# EAGLE schematic SP-PC (EAGLE 7.6.0)

## Sheet 1 of 2
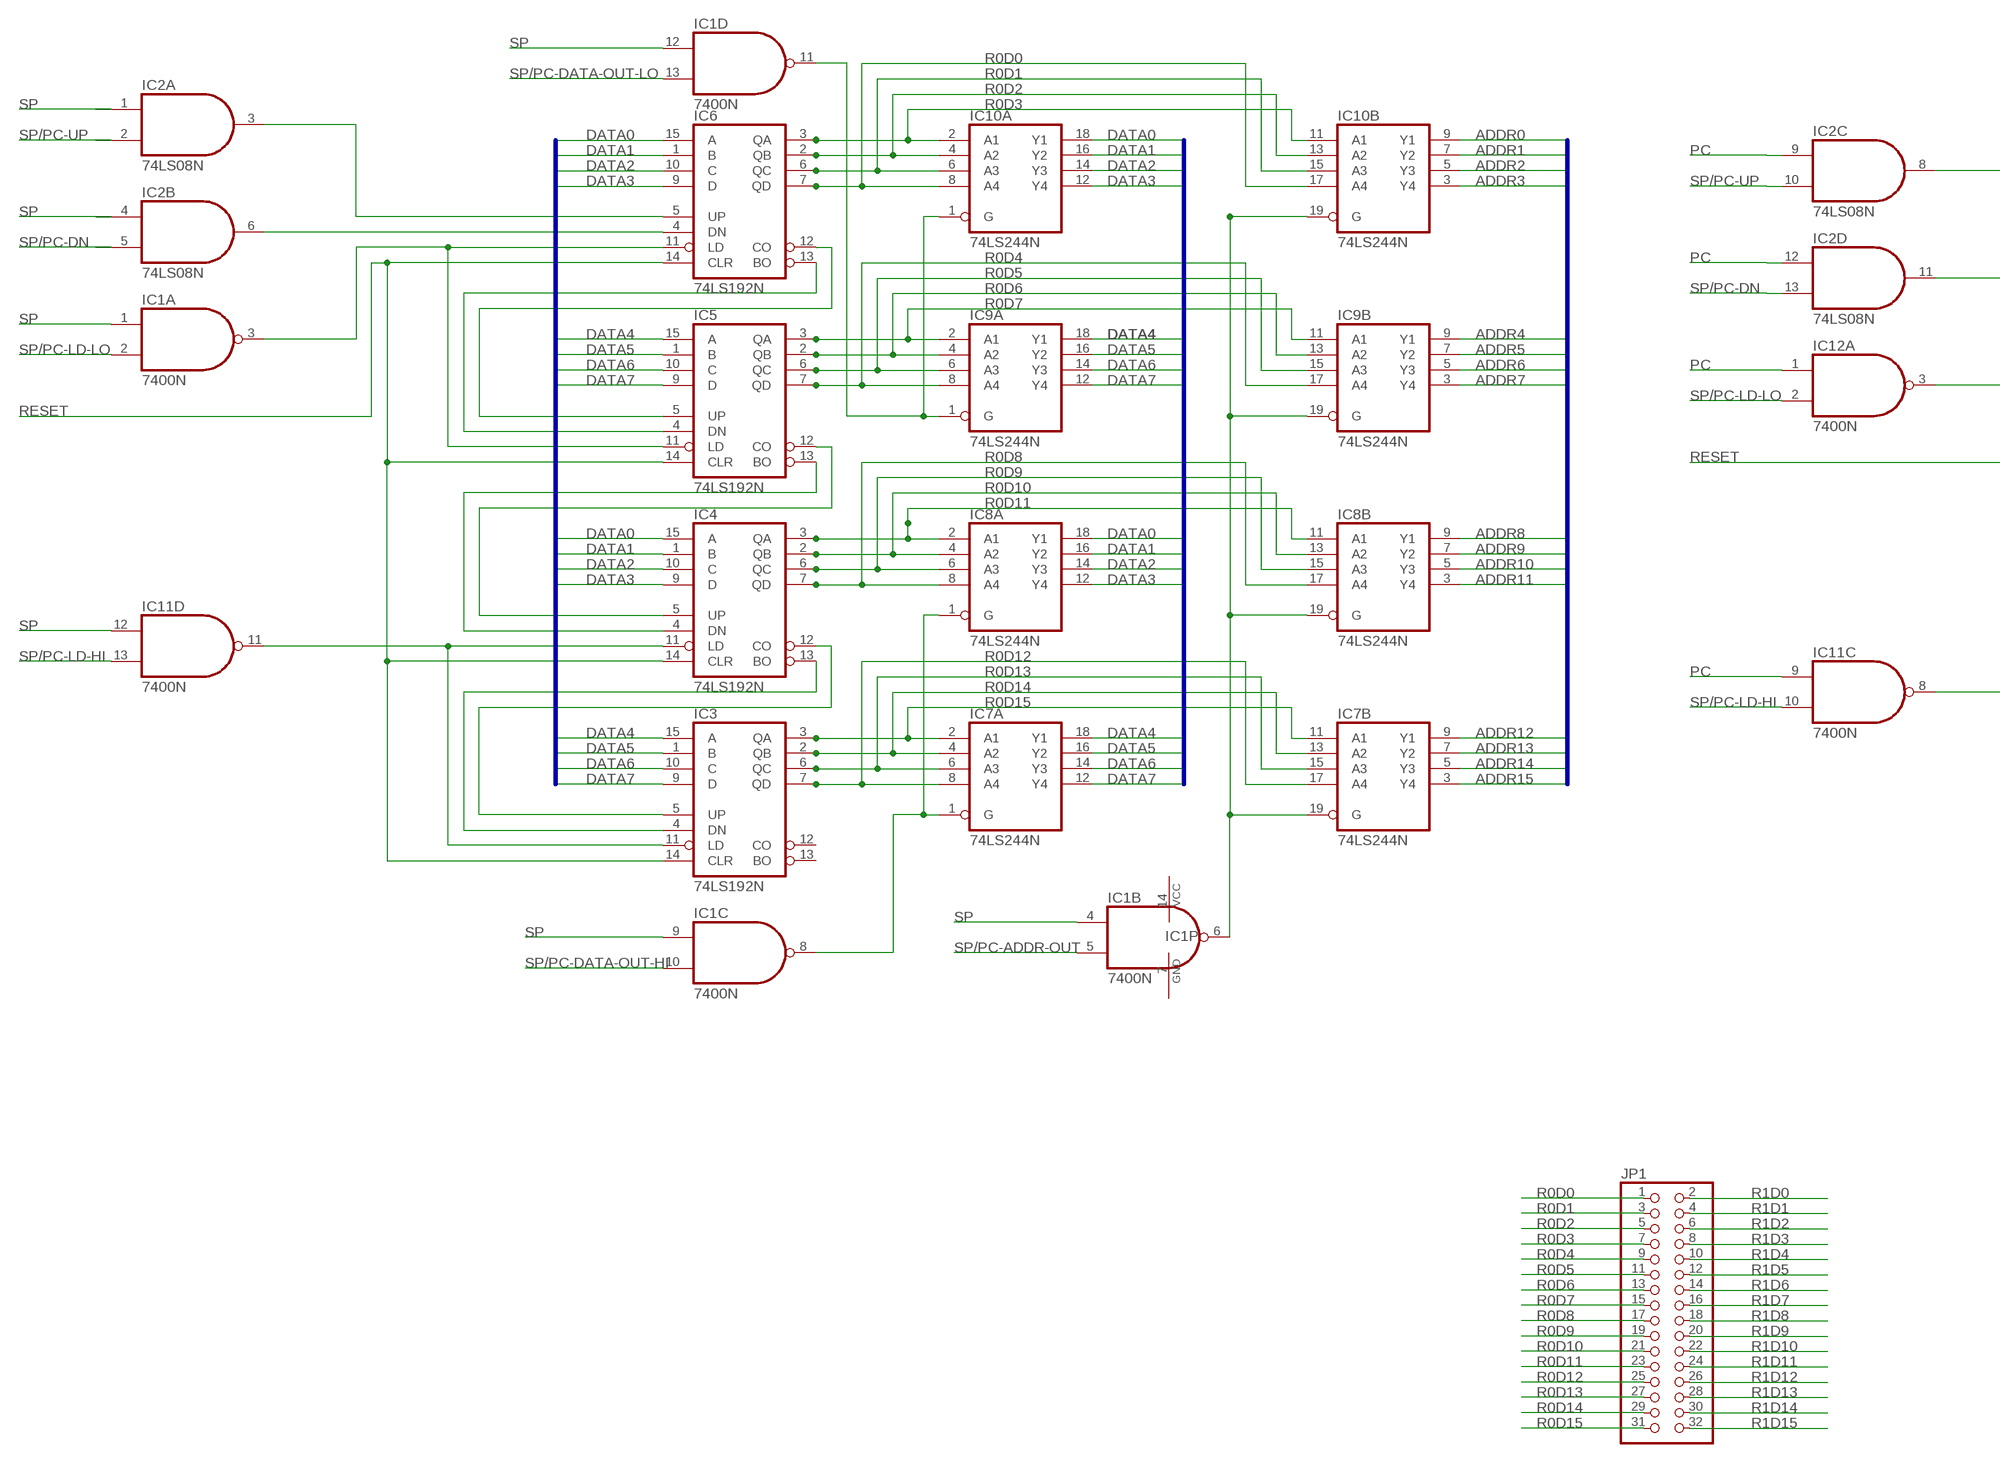
[diagram p0: schematic, sheet 1, part 1 of 2]
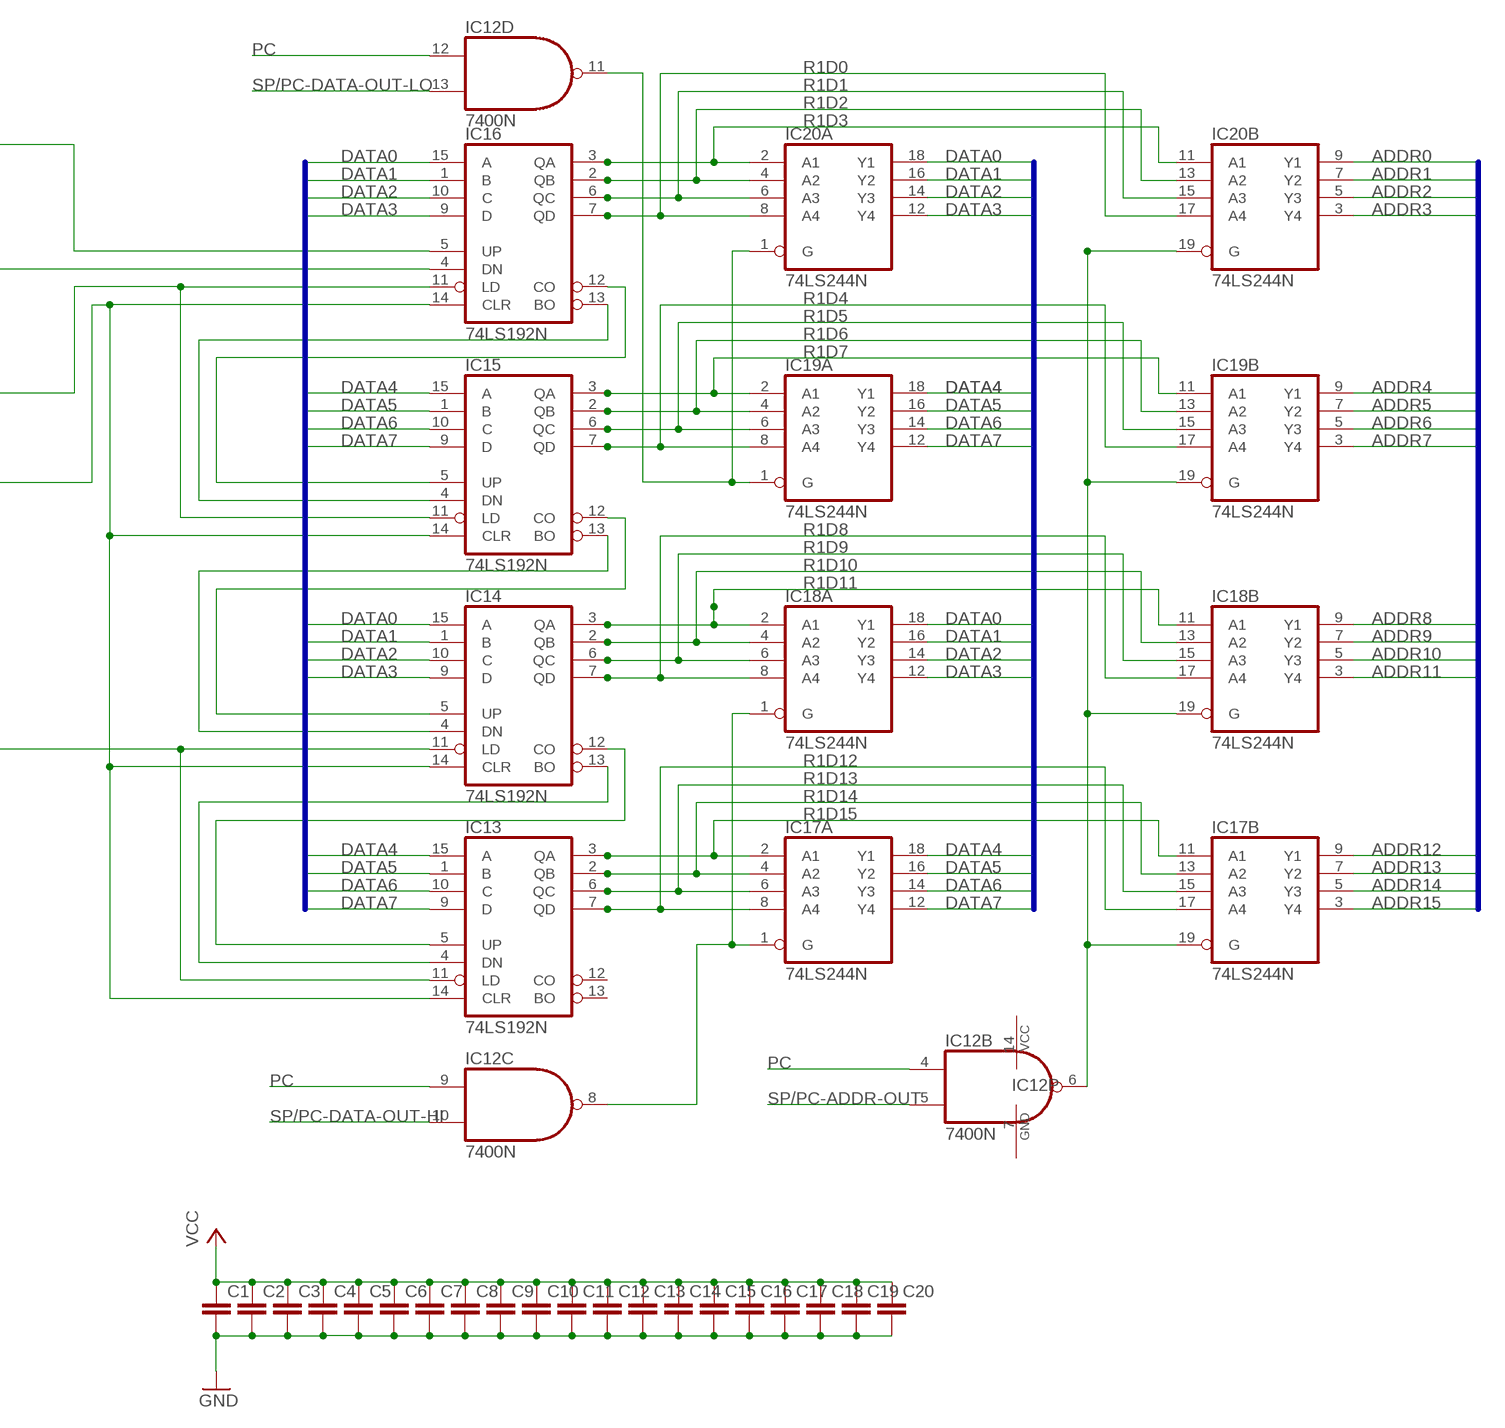
[diagram p1: schematic, sheet 1, part 2 of 2]

### Parts
C1  C2.5/2  [C2.5-2]
C2  C2.5/2  [C2.5-2]
C3  C2.5/2  [C2.5-2]
C4  C2.5/2  [C2.5-2]
C5  C2.5/2  [C2.5-2]
C6  C2.5/2  [C2.5-2]
C7  C2.5/2  [C2.5-2]
C8  C2.5/2  [C2.5-2]
C9  C2.5/2  [C2.5-2]
C10  C2.5/2  [C2.5-2]
C11  C2.5/2  [C2.5-2]
C12  C2.5/2  [C2.5-2]
C13  C2.5/2  [C2.5-2]
C14  C2.5/2  [C2.5-2]
C15  C2.5/2  [C2.5-2]
C16  C2.5/2  [C2.5-2]
C17  C2.5/2  [C2.5-2]
C18  C2.5/2  [C2.5-2]
C19  C2.5/2  [C2.5-2]
C20  C2.5/2  [C2.5-2]
IC1  7400N  [DIL14]
IC2  74LS08N  [DIL14]
IC3  74LS192N  [DIL16]
IC4  74LS192N  [DIL16]
IC5  74LS192N  [DIL16]
IC6  74LS192N  [DIL16]
IC7  74LS244N  [DIL20]
IC8  74LS244N  [DIL20]
IC9  74LS244N  [DIL20]
IC10  74LS244N  [DIL20]
IC11  7400N  [DIL14]
IC12  7400N  [DIL14]
IC13  74LS192N  [DIL16]
IC14  74LS192N  [DIL16]
IC15  74LS192N  [DIL16]
IC16  74LS192N  [DIL16]
IC17  74LS244N  [DIL20]
IC18  74LS244N  [DIL20]
IC19  74LS244N  [DIL20]
IC20  74LS244N  [DIL20]
JP1  PINHD-2X16  [2X16]

### Nets
ADDR0: IC10.9(B:Y1) IC20.9(B:Y1) ; also sheet 2
ADDR1: IC10.7(B:Y2) IC20.7(B:Y2) ; also sheet 2
ADDR2: IC10.5(B:Y3) IC20.5(B:Y3) ; also sheet 2
ADDR3: IC10.3(B:Y4) IC20.3(B:Y4) ; also sheet 2
ADDR4: IC9.9(B:Y1) IC19.9(B:Y1) ; also sheet 2
ADDR5: IC9.7(B:Y2) IC19.7(B:Y2) ; also sheet 2
ADDR6: IC9.5(B:Y3) IC19.5(B:Y3) ; also sheet 2
ADDR7: IC9.3(B:Y4) IC19.3(B:Y4) ; also sheet 2
ADDR8: IC8.9(B:Y1) IC18.9(B:Y1) ; also sheet 2
ADDR9: IC8.7(B:Y2) IC18.7(B:Y2) ; also sheet 2
ADDR10: IC8.5(B:Y3) IC18.5(B:Y3) ; also sheet 2
ADDR11: IC8.3(B:Y4) IC18.3(B:Y4) ; also sheet 2
ADDR12: IC7.9(B:Y1) IC17.9(B:Y1) ; also sheet 2
ADDR13: IC7.7(B:Y2) IC17.7(B:Y2) ; also sheet 2
ADDR14: IC7.5(B:Y3) IC17.5(B:Y3) ; also sheet 2
ADDR15: IC7.3(B:Y4) IC17.3(B:Y4) ; also sheet 2
DATA0: IC4.15(A) IC6.15(A) IC8.18(A:Y1) IC10.18(A:Y1) IC14.15(A) IC16.15(A) IC18.18(A:Y1) IC20.18(A:Y1) ; also sheet 2
DATA1: IC4.1(B) IC6.1(B) IC8.16(A:Y2) IC10.16(A:Y2) IC14.1(B) IC16.1(B) IC18.16(A:Y2) IC20.16(A:Y2) ; also sheet 2
DATA2: IC4.10(C) IC6.10(C) IC8.14(A:Y3) IC10.14(A:Y3) IC14.10(C) IC16.10(C) IC18.14(A:Y3) IC20.14(A:Y3) ; also sheet 2
DATA3: IC4.9(D) IC6.9(D) IC8.12(A:Y4) IC10.12(A:Y4) IC14.9(D) IC16.9(D) IC18.12(A:Y4) IC20.12(A:Y4) ; also sheet 2
DATA4: IC3.15(A) IC5.15(A) IC7.18(A:Y1) IC9.18(A:Y1) IC13.15(A) IC15.15(A) IC17.18(A:Y1) IC19.18(A:Y1) ; also sheet 2
DATA5: IC3.1(B) IC5.1(B) IC7.16(A:Y2) IC9.16(A:Y2) IC13.1(B) IC15.1(B) IC17.16(A:Y2) IC19.16(A:Y2) ; also sheet 2
DATA6: IC3.10(C) IC5.10(C) IC7.14(A:Y3) IC9.14(A:Y3) IC13.10(C) IC15.10(C) IC17.14(A:Y3) IC19.14(A:Y3) ; also sheet 2
DATA7: IC3.9(D) IC5.9(D) IC7.12(A:Y4) IC9.12(A:Y4) IC13.9(D) IC15.9(D) IC17.12(A:Y4) IC19.12(A:Y4) ; also sheet 2
GND: C1.2 C2.2 C3.2 C4.2 C5.2 C6.2 C7.2 C8.2 C9.2 C10.2 C11.2 C12.2 C13.2 C14.2 C15.2 C16.2 C17.2 C18.2 C19.2 C20.2 ; also sheet 2
N$10: IC5.4(DN) IC6.13(BO)
N$11: IC5.5(UP) IC6.12(CO)
N$12: IC4.4(DN) IC5.13(BO)
N$13: IC4.5(UP) IC5.12(CO)
N$14: IC3.4(DN) IC4.13(BO)
N$15: IC3.5(UP) IC4.12(CO)
N$16: IC1.3(A:O) IC5.11(LD) IC6.11(LD)
N$17: IC2.3(A:O) IC6.5(UP)
N$18: IC2.6(B:O) IC6.4(DN)
N$19: IC1.6(B:O) IC7.19(B:G) IC8.19(B:G) IC9.19(B:G) IC10.19(B:G)
N$20: IC1.11(D:O) IC9.1(A:G) IC10.1(A:G)
N$21: IC1.8(C:O) IC7.1(A:G) IC8.1(A:G)
N$22: IC3.11(LD) IC4.11(LD) IC11.11(D:O)
N$58: IC15.4(DN) IC16.13(BO)
N$59: IC15.5(UP) IC16.12(CO)
N$60: IC14.4(DN) IC15.13(BO)
N$61: IC14.5(UP) IC15.12(CO)
N$62: IC13.4(DN) IC14.13(BO)
N$63: IC13.5(UP) IC14.12(CO)
N$64: IC12.3(A:O) IC15.11(LD) IC16.11(LD)
N$65: IC2.8(C:O) IC16.5(UP)
N$66: IC2.11(D:O) IC16.4(DN)
N$83: IC12.6(B:O) IC17.19(B:G) IC18.19(B:G) IC19.19(B:G) IC20.19(B:G)
N$84: IC12.11(D:O) IC19.1(A:G) IC20.1(A:G)
N$85: IC12.8(C:O) IC17.1(A:G) IC18.1(A:G)
N$86: IC11.8(C:O) IC13.11(LD) IC14.11(LD)
PC: IC2.9(C:I0) IC2.12(D:I0) IC11.9(C:I0) IC12.1(A:I0) IC12.4(B:I0) IC12.9(C:I0) IC12.12(D:I0)
R0D0: IC6.7(QD) IC10.8(A:A4) IC10.17(B:A4) JP1.1
R0D1: IC6.6(QC) IC10.6(A:A3) IC10.15(B:A3) JP1.3
R0D2: IC6.2(QB) IC10.4(A:A2) IC10.13(B:A2) JP1.5
R0D3: IC6.3(QA) IC10.2(A:A1) IC10.11(B:A1) JP1.7
R0D4: IC5.7(QD) IC9.8(A:A4) IC9.17(B:A4) JP1.9
R0D5: IC5.6(QC) IC9.6(A:A3) IC9.15(B:A3) JP1.11
R0D6: IC5.2(QB) IC9.4(A:A2) IC9.13(B:A2) JP1.13
R0D7: IC5.3(QA) IC9.2(A:A1) IC9.11(B:A1) JP1.15
R0D8: IC4.7(QD) IC8.8(A:A4) IC8.17(B:A4) JP1.17
R0D9: IC4.6(QC) IC8.6(A:A3) IC8.15(B:A3) JP1.19
R0D10: IC4.2(QB) IC8.4(A:A2) IC8.13(B:A2) JP1.21
R0D11: IC4.3(QA) IC8.2(A:A1) IC8.11(B:A1) JP1.23
R0D12: IC3.7(QD) IC7.8(A:A4) IC7.17(B:A4) JP1.25
R0D13: IC3.6(QC) IC7.6(A:A3) IC7.15(B:A3) JP1.27
R0D14: IC3.2(QB) IC7.4(A:A2) IC7.13(B:A2) JP1.29
R0D15: IC3.3(QA) IC7.2(A:A1) IC7.11(B:A1) JP1.31
R1D0: IC16.7(QD) IC20.8(A:A4) IC20.17(B:A4) JP1.2
R1D1: IC16.6(QC) IC20.6(A:A3) IC20.15(B:A3) JP1.4
R1D2: IC16.2(QB) IC20.4(A:A2) IC20.13(B:A2) JP1.6
R1D3: IC16.3(QA) IC20.2(A:A1) IC20.11(B:A1) JP1.8
R1D4: IC15.7(QD) IC19.8(A:A4) IC19.17(B:A4) JP1.10
R1D5: IC15.6(QC) IC19.6(A:A3) IC19.15(B:A3) JP1.12
R1D6: IC15.2(QB) IC19.4(A:A2) IC19.13(B:A2) JP1.14
R1D7: IC15.3(QA) IC19.2(A:A1) IC19.11(B:A1) JP1.16
R1D8: IC14.7(QD) IC18.8(A:A4) IC18.17(B:A4) JP1.18
R1D9: IC14.6(QC) IC18.6(A:A3) IC18.15(B:A3) JP1.20
R1D10: IC14.2(QB) IC18.4(A:A2) IC18.13(B:A2) JP1.22
R1D11: IC14.3(QA) IC18.2(A:A1) IC18.11(B:A1) JP1.24
R1D12: IC13.7(QD) IC17.8(A:A4) IC17.17(B:A4) JP1.26
R1D13: IC13.6(QC) IC17.6(A:A3) IC17.15(B:A3) JP1.28
R1D14: IC13.2(QB) IC17.4(A:A2) IC17.13(B:A2) JP1.30
R1D15: IC13.3(QA) IC17.2(A:A1) IC17.11(B:A1) JP1.32
RESET: IC3.14(CLR) IC4.14(CLR) IC5.14(CLR) IC6.14(CLR) IC13.14(CLR) IC14.14(CLR) IC15.14(CLR) IC16.14(CLR) ; also sheet 2
SP: IC1.1(A:I0) IC1.4(B:I0) IC1.9(C:I0) IC1.12(D:I0) IC2.1(A:I0) IC2.4(B:I0) IC11.12(D:I0)
SP/PC-ADDR-OUT: IC1.5(B:I1) IC12.5(B:I1) ; also sheet 2
SP/PC-DATA-OUT-HI: IC1.10(C:I1) IC12.10(C:I1) ; also sheet 2
SP/PC-DATA-OUT-LO: IC1.13(D:I1) IC12.13(D:I1) ; also sheet 2
SP/PC-DN: IC2.5(B:I1) IC2.13(D:I1) ; also sheet 2
SP/PC-LD-HI: IC11.10(C:I1) IC11.13(D:I1)
SP/PC-LD-LO: IC1.2(A:I1) IC12.2(A:I1)
SP/PC-UP: IC2.2(A:I1) IC2.10(C:I1) ; also sheet 2
VCC: C1.1 C2.1 C3.1 C4.1 C5.1 C6.1 C7.1 C8.1 C9.1 C10.1 C11.1 C12.1 C13.1 C14.1 C15.1 C16.1 C17.1 C18.1 C19.1 C20.1 ; also sheet 2
Unconnected: IC3.12(CO) IC3.13(BO) IC11.1(A:I0) IC11.2(A:I1) IC11.3(A:O) IC11.4(B:I0) IC11.5(B:I1) IC11.6(B:O) IC13.12(CO) IC13.13(BO)

### Buses
ADDR[0..15]
DATA[0..7]

## Sheet 2 of 2
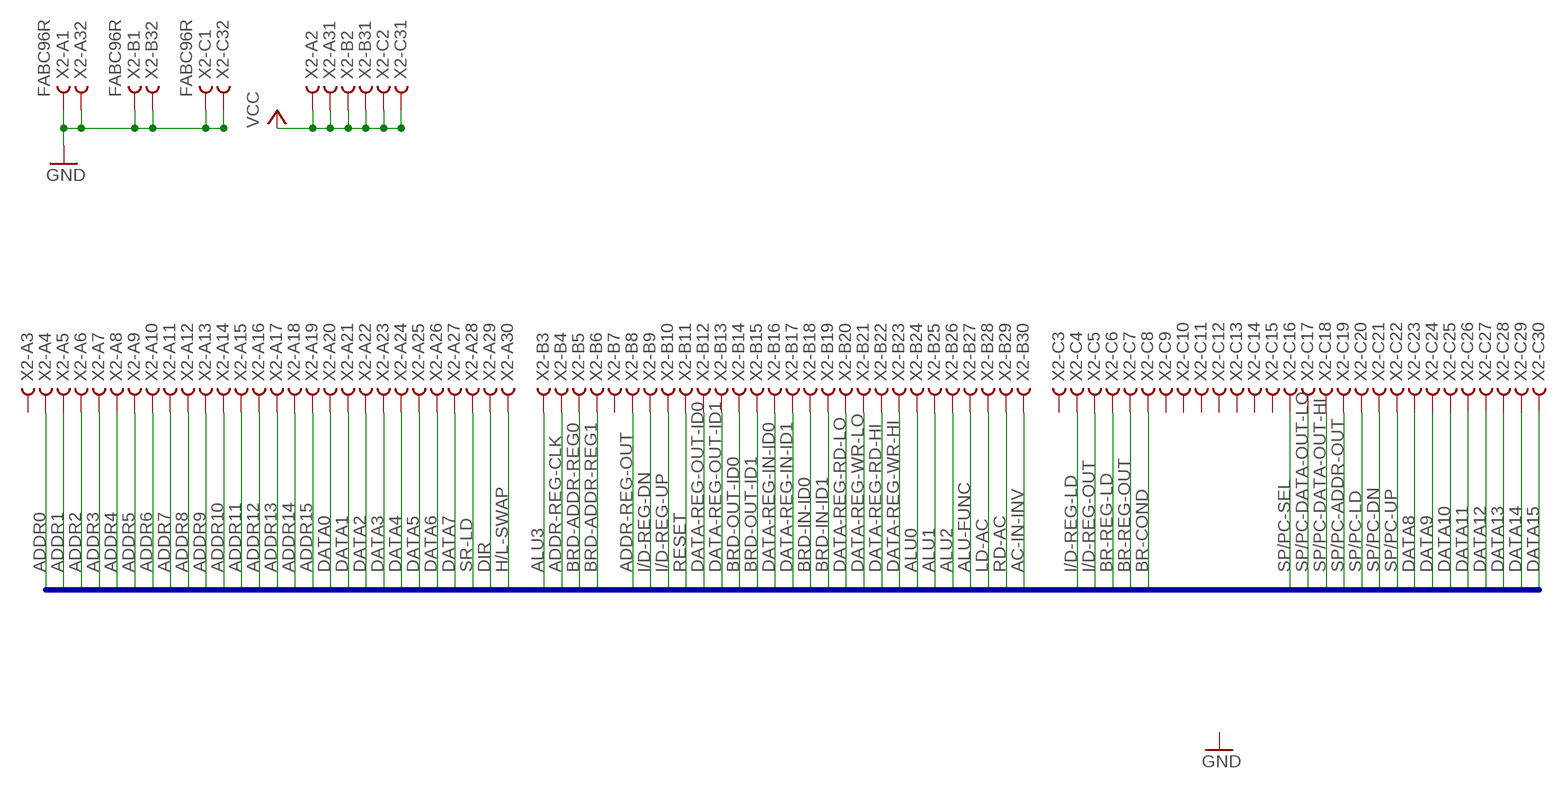
[diagram p2: schematic, sheet 2]

### Parts
X2  FABC96R  [FABC96R]

### Nets
AC-IN-INV: X2.B30
ADDR0: X2.A4 ; also sheet 1
ADDR1: X2.A5 ; also sheet 1
ADDR2: X2.A6 ; also sheet 1
ADDR3: X2.A7 ; also sheet 1
ADDR4: X2.A8 ; also sheet 1
ADDR5: X2.A9 ; also sheet 1
ADDR6: X2.A10 ; also sheet 1
ADDR7: X2.A11 ; also sheet 1
ADDR8: X2.A12 ; also sheet 1
ADDR9: X2.A13 ; also sheet 1
ADDR10: X2.A14 ; also sheet 1
ADDR11: X2.A15 ; also sheet 1
ADDR12: X2.A16 ; also sheet 1
ADDR13: X2.A17 ; also sheet 1
ADDR14: X2.A18 ; also sheet 1
ADDR15: X2.A19 ; also sheet 1
ADDR-REG-CLK: X2.B4
ADDR-REG-OUT: X2.B8
ALU0: X2.B24
ALU1: X2.B25
ALU2: X2.B26
ALU3: X2.B3
ALU-FUNC: X2.B27
BR-COND: X2.C8
BR-REG-LD: X2.C6
BR-REG-OUT: X2.C7
BRD-ADDR-REG0: X2.B5
BRD-ADDR-REG1: X2.B6
BRD-IN-ID0: X2.B18
BRD-IN-ID1: X2.B19
BRD-OUT-ID0: X2.B14
BRD-OUT-ID1: X2.B15
DATA0: X2.A20 ; also sheet 1
DATA1: X2.A21 ; also sheet 1
DATA2: X2.A22 ; also sheet 1
DATA3: X2.A23 ; also sheet 1
DATA4: X2.A24 ; also sheet 1
DATA5: X2.A25 ; also sheet 1
DATA6: X2.A26 ; also sheet 1
DATA7: X2.A27 ; also sheet 1
DATA8: X2.C23
DATA9: X2.C24
DATA10: X2.C25
DATA11: X2.C26
DATA12: X2.C27
DATA13: X2.C28
DATA14: X2.C29
DATA15: X2.C30
DATA-REG-IN-ID0: X2.B16
DATA-REG-IN-ID1: X2.B17
DATA-REG-OUT-ID0: X2.B12
DATA-REG-OUT-ID1: X2.B13
DATA-REG-RD-HI: X2.B22
DATA-REG-RD-LO: X2.B20
DATA-REG-WR-HI: X2.B23
DATA-REG-WR-LO: X2.B21
DIR: X2.A29
GND: X2.A1 X2.A32 X2.B1 X2.B32 X2.C1 X2.C32 ; also sheet 1
H/L-SWAP: X2.A30
I/D-REG-DN: X2.B9
I/D-REG-LD: X2.C4
I/D-REG-OUT: X2.C5
I/D-REG-UP: X2.B10
LD-AC: X2.B28
RD-AC: X2.B29
RESET: X2.B11 ; also sheet 1
SP/PC-ADDR-OUT: X2.C19 ; also sheet 1
SP/PC-DATA-OUT-HI: X2.C18 ; also sheet 1
SP/PC-DATA-OUT-LO: X2.C17 ; also sheet 1
SP/PC-DN: X2.C21 ; also sheet 1
SP/PC-LD: X2.C20
SP/PC-SEL: X2.C16
SP/PC-UP: X2.C22 ; also sheet 1
SR-LD: X2.A28
VCC: X2.A2 X2.A31 X2.B2 X2.B31 X2.C2 X2.C31 ; also sheet 1
Unconnected: X2.A3 X2.B7 X2.C3 X2.C9 X2.C10 X2.C11 X2.C12 X2.C13 X2.C14 X2.C15

### Buses
ADDR[0..15],DATA[0..15],DIR,H/L-SWAP,ADDR-REG-CLK,BRD-ADDR-REG[0..1],ADDR-REG-OUT,I/D-REG-DN,I/D-REG-UP,RESET,DATA-REG-OUT-ID[0..1],BRD-OUT-ID[0..1],DATA-REG-IN-ID[0..1],BRD-IN-ID[0..1],DATA-REG-RD-LO,DATA-REG-WR-LO,DATA-REG-RD-HI,DATA-REG-WR-HI,ALU[0..3],ALU-FUNC,LD-AC,RD-AC,AC-IN-INV,I/D-REG-LD,I/D-REG-OUT,BR-REG-LD,BR-REG-OUT,BR-COND,SP/PC-SEL,SP/PC-DATA-OUT-LO,SP/PC-DATA-OUT-HI,SP/PC-ADDR-OUT,SP/PC-LD,SP/PC-DN,SP/PC-UP,SR-LD

## Power pins joined to a net without a drawn wire
GND: IC1.7(P:GND) IC2.7(P:GND) IC3.8(GND) IC4.8(GND) IC5.8(GND) IC6.8(GND) IC7.10(P:GND) IC8.10(P:GND) IC9.10(P:GND) IC10.10(P:GND) IC11.7(P:GND) IC12.7(P:GND) IC13.8(GND) IC14.8(GND) IC15.8(GND) IC16.8(GND) IC17.10(P:GND) IC18.10(P:GND) IC19.10(P:GND) IC20.10(P:GND)
VCC: IC1.14(P:VCC) IC2.14(P:VCC) IC3.16(VCC) IC4.16(VCC) IC5.16(VCC) IC6.16(VCC) IC7.20(P:VCC) IC8.20(P:VCC) IC9.20(P:VCC) IC10.20(P:VCC) IC11.14(P:VCC) IC12.14(P:VCC) IC13.16(VCC) IC14.16(VCC) IC15.16(VCC) IC16.16(VCC) IC17.20(P:VCC) IC18.20(P:VCC) IC19.20(P:VCC) IC20.20(P:VCC)

## Library data of the parts
C1-C20 = capacitor-wima:C: CAPACITOR naming: grid - package width
IC1 IC11 IC12 = 74xx-us:74*00: Quad 2-input NAND gate
IC2 = 74xx-us:74*08: Quad 2-input AND gate
IC3-IC6 IC13-IC16 = 74xx-us:74*192: Synchronous 4-bit UP/DOWN COUNTER
IC7-IC10 IC17-IC20 = 74xx-us:74*244: Octal BUFFER and LINE DRIVER, 3-state
JP1 = pinhead:PINHD-2X16: PIN HEADER
X2 = con-vg:FABC96R: CONNECTOR female, 96 pins, type R, rows ABC, grid 2.54 mm